# Altium schematic sheet BoardB-LEDs.SchDoc
size A; SheetNumber: 8; SheetTotal: 9
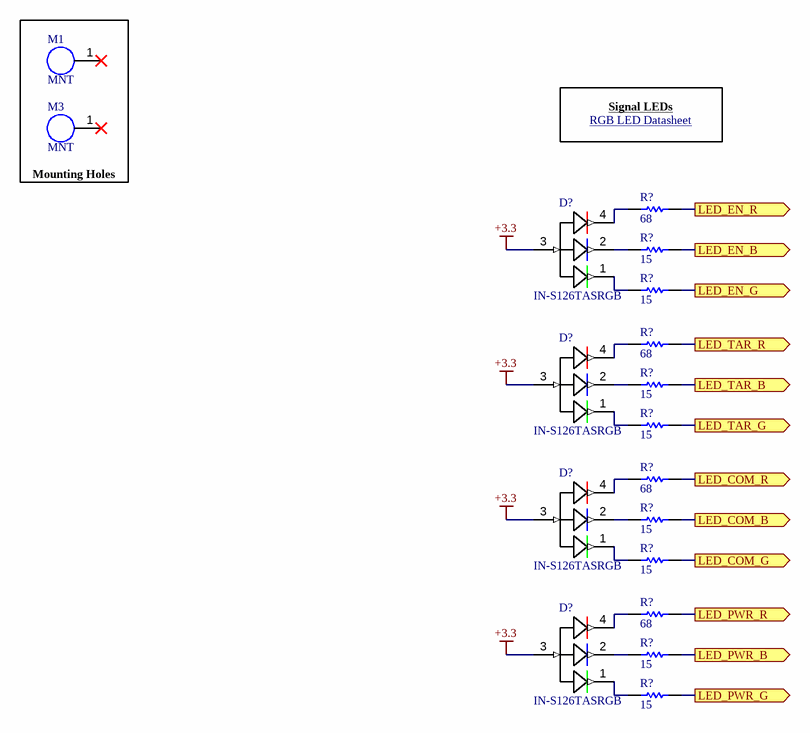
[diagram p0: BoardB-LEDs.SchDoc]

## Parts
(Parts that share a designator on the sheet are numbered #1, #2 ... from top to bottom, then left to right.)
D?#1  IN-S126TASRGB
D?#2  IN-S126TASRGB
D?#3  IN-S126TASRGB
D?#4  IN-S126TASRGB
M1  MNT  [MNT]
M3  MNT  [MNT]
R?#1  68  [RESC1005X40X25ML05T05]
R?#2  15  [RESC1005X40X25LL05T05]
R?#3  15  [RESC1005X40X25LL05T05]
R?#4  68  [RESC1005X40X25ML05T05]
R?#5  15  [RESC1005X40X25LL05T05]
R?#6  15  [RESC1005X40X25LL05T05]
R?#7  68  [RESC1005X40X25ML05T05]
R?#8  15  [RESC1005X40X25LL05T05]
R?#9  15  [RESC1005X40X25LL05T05]
R?#10  68  [RESC1005X40X25ML05T05]
R?#11  15  [RESC1005X40X25LL05T05]
R?#12  15  [RESC1005X40X25LL05T05]

## Blocks framed on the sheet
Mounting Holes: M1 M3

## Ports
LED_COM_B (out), LED_COM_G (out), LED_COM_R (out), LED_EN_B (out), LED_EN_G (out), LED_EN_R (out), LED_PWR_B (out), LED_PWR_G (out), LED_PWR_R (out), LED_TAR_B (out), LED_TAR_G (out), LED_TAR_R (out)

## Nets
+3.3: D?#1.3 D?#2.3 D?#3.3 D?#4.3
LED_COM_B: R?#8.2 ; port LED_COM_B
LED_COM_G: R?#9.2 ; port LED_COM_G
LED_COM_R: R?#7.2 ; port LED_COM_R
LED_EN_B: R?#2.2 ; port LED_EN_B
LED_EN_G: R?#3.2 ; port LED_EN_G
LED_EN_R: R?#1.2 ; port LED_EN_R
LED_PWR_B: R?#11.2 ; port LED_PWR_B
LED_PWR_G: R?#12.2 ; port LED_PWR_G
LED_PWR_R: R?#10.2 ; port LED_PWR_R
LED_TAR_B: R?#5.2 ; port LED_TAR_B
LED_TAR_G: R?#6.2 ; port LED_TAR_G
LED_TAR_R: R?#4.2 ; port LED_TAR_R
NetD?#1_1: D?#1.1 R?#3.1
NetD?#1_2: D?#1.2 R?#2.1
NetD?#1_4: D?#1.4 R?#1.1
NetD?#2_1: D?#2.1 R?#6.1
NetD?#2_2: D?#2.2 R?#5.1
NetD?#2_4: D?#2.4 R?#4.1
NetD?#3_1: D?#3.1 R?#9.1
NetD?#3_2: D?#3.2 R?#8.1
NetD?#3_4: D?#3.4 R?#7.1
NetD?#4_1: D?#4.1 R?#12.1
NetD?#4_2: D?#4.2 R?#11.1
NetD?#4_4: D?#4.4 R?#10.1

Not connected (* = marked no-connect by the designer): M1 1*; M3 1*

## Notes on the sheet
- Signal LEDs
- RGB LED Datasheet <http://www.inolux-corp.com/datasheet/SMDLED/RGB%20Side%20View/IN-S126TASRGB_V1.1.pdf>

## Library data of the parts
D?#1-D?#4 = IN-S126TASRGB: LED Tri-Color Blue/Green/Red 470nm/523nm/625nm Automotive 4-Pin Chip 1206(3216Metric) T/R; Manufacturer: Inolux; Supplier 1: Digi-Key; Manufacturer Part Number: IN-S126TASRGB; RoHS: No; Category: LEDs; Stock 1: 49322; Pricing 1: 1=0.58000, 10=0.37900, 100=0.25070, 1000=0.19356 (USD); Supplier Part Number 1: 1830-1052-1-ND
R?#1 R?#4 R?#7 R?#10 = CMP-2002-01170-1: Manufacturer: Panasonic; Part Number: ERJ2RKF68R0X
R?#2 R?#3 R?#5 R?#6 R?#8 R?#9 R?#11 R?#12 = CMP-1011-00302-2: Manufacturer: Panasonic; Part Number: ERJ-2RKF15R0X